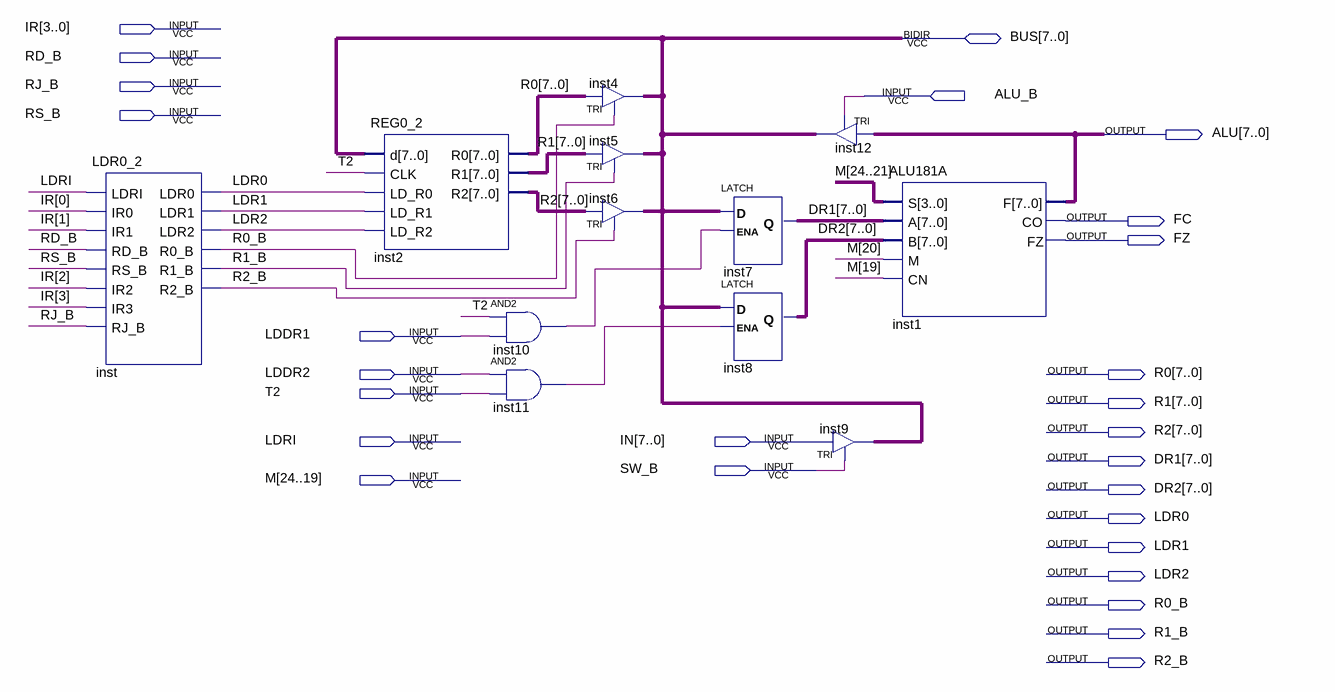
[diagram p0: schematic sheet]
// Quartus schematic ALU_MD.bdf as structural Verilog: 12 symbols, 27 pins
module ALU_MD (
  input  [3:0] IR,
  input  RD_B,
  input  RJ_B,
  input  ALU_B,
  input  RS_B,
  input  LDDR1,
  input  LDDR2,
  input  T2,
  input  LDRI,
  input  [7:0] IN,
  input  SW_B,
  input  [24:19] M,
  inout  [7:0] BUS,
  output [7:0] ALU,
  output FC,
  output FZ,
  output [7:0] R0,
  output [7:0] R1,
  output [7:0] R2,
  output [7:0] DR1,
  output [7:0] DR2,
  output LDR0,
  output LDR1,
  output LDR2,
  output R0_B,
  output R1_B,
  output R2_B
);

  wire inst10_out, inst11_out;

  LDR0_2 inst (
    .LDRI(LDRI), .IR0(IR[0]), .IR1(IR[1]), .RD_B(RD_B), .RS_B(RS_B), .IR2(IR[2]), .IR3(IR[3]), .RJ_B(RJ_B),
    .LDR0(LDR0), .LDR1(LDR1), .LDR2(LDR2), .R0_B(R0_B), .R1_B(R1_B), .R2_B(R2_B));
  REG0_2 inst2 (.d(BUS), .CLK(T2), .LD_R0(LDR0), .LD_R1(LDR1), .LD_R2(LDR2), .R0(R0), .R1(R1), .R2(R2));
  and inst10 (inst10_out, T2, LDDR1);
  and inst11 (inst11_out, LDDR2, T2);
  TRI inst4[7:0] (.IN(R0), .OE(R0_B), .OUT(BUS));
  TRI inst5[7:0] (.IN(R1), .OE(R1_B), .OUT(BUS));
  TRI inst6[7:0] (.IN(R2), .OE(R2_B), .OUT(BUS));
  LATCH inst7[7:0] (.D(BUS), .ENA(inst10_out), .Q(DR1));
  LATCH inst8[7:0] (.D(BUS), .ENA(inst11_out), .Q(DR2));
  TRI inst12[7:0] (.IN(ALU), .OE(ALU_B), .OUT(BUS));
  TRI inst9[7:0] (.IN(IN), .OE(SW_B), .OUT(BUS));
  ALU181A inst1 (.S(M[24:21]), .A(DR1), .B(DR2), .M(M[20]), .CN(M[19]), .F(ALU), .CO(FC), .FZ(FZ));
endmodule
